# Altium schematic sheet protel_wireless_receiver.SchDoc
size A4
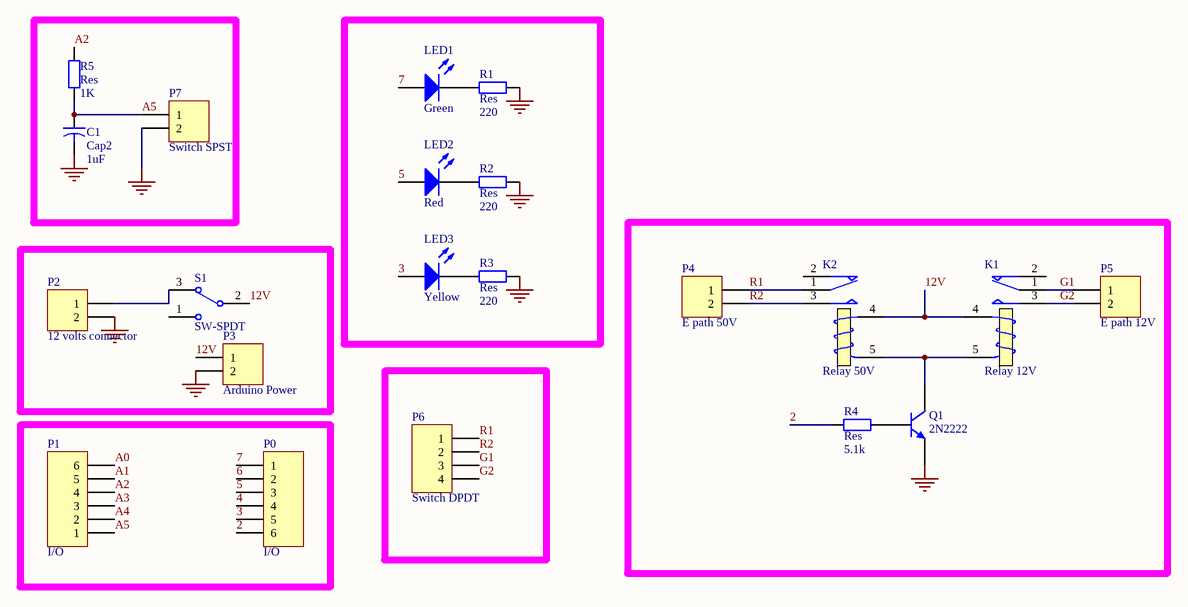
[diagram p0: protel_wireless_receiver.SchDoc]

## Parts
C1  Cap2  value 1uF  [CAPR5-4X5]
K1  Relay 12V  [relay 6pin]
K2  Relay 50V  [JS relay]
LED1  Green  [LED-1]
LED2  Red  [LED-1]
LED3  Yellow  [LED-1]
P0  I/O  [HDR1X6]
P1  I/O  [HDR1X6]
P2  12 volts connector  [HDR1X2]
P3  Arduino Power  [HDR1X2]
P4  E path 50V  [HDR1X2]
P5  E path 12V  [HDR1X2]
P6  Switch DPDT  [HDR1X4]
P7  Switch SPST  [HDR1X2]
Q1  2N2222  [CAN-3/D5.9]
R1  Res  value 220  [AXIAL-0.4]
R2  Res  value 220  [AXIAL-0.4]
R3  Res  value 220  [AXIAL-0.4]
R4  Res  value 5.1k  [AXIAL-0.4]
R5  Res  value 1K  [AXIAL-0.4]
S1  SW-SPDT  [SPDT]

## Nets
GND: C1.2 P2.2 P3.2 P7.2 Q1.1(E) R1.2 R2.2 R3.2
2: P0.6 R4.1
3: LED3.1(A) P0.5
4: P0.4
5: LED2.1(A) P0.3
6: P0.2
7: LED1.1(A) P0.1
12V: K1.4(T1) K2.4(T1) P3.1 S1.2
A0: P1.6
A1: P1.5
A2: P1.4 R5.2
A3: P1.3
A4: P1.2
A5: C1.1 P1.1 P7.1 R5.1
G1: K1.1(COM) P5.1 P6.3
G2: K1.3(NO) P5.2 P6.4
R1: K2.1(COM) P4.1 P6.1
R2: K2.3(NO) P4.2 P6.2
NetK1_5: K1.5(T2) K2.5(T2) Q1.3(C)
NetLED1_2: LED1.2(K) R1.1
NetLED2_2: LED2.2(K) R2.1
NetLED3_2: LED3.2(K) R3.1
NetP2_1: P2.1 S1.3
NetQ1_2: Q1.2(B) R4.2

Not connected (* = marked no-connect by the designer): K1 2(NC); K2 2(NC); S1 1

## Library data of the parts
C1 = Cap2: Capacitor; Published: 23-Sep-2002; Publisher: Altium Limited
K1 K2 = Relay: SPDT Relay; Published: 8-Jun-2000; LatestRevisionDate: 17-Jul-2002; LatestRevisionNote: Re-released for DXP Platform.; Publisher: Altium Limited
LED1-LED3 = LED1: Typical RED GaAs LED; Published: 8-Jun-2000; LatestRevisionDate: 17-Jul-2002; LatestRevisionNote: Re-released for DXP Platform.; Publisher: Altium Limited
P0 P1 = Header 6: Header, 6-Pin; LatestRevisionDate: 17-Jul-2002; LatestRevisionNote: Re-released for DXP Platform.; Publisher: Altium Limited
P2-P5 P7 = Header 2: Header, 2-Pin; LatestRevisionDate: 17-Jul-2002; LatestRevisionNote: Re-released for DXP Platform.; Publisher: Altium Limited
P6 = Header 4: Header, 4-Pin; LatestRevisionDate: 17-Jul-2002; LatestRevisionNote: Re-released for DXP Platform.; Publisher: Altium Limited
Q1 = 2N2222: General Purpose Transistor NPN Silicon; Published: 29-Sep-2000; LatestRevisionDate: 17-Jul-2002; LatestRevisionNote: Re-released for DXP Platform.; DatasheetVersion: 1991; PackageVersion: 1997; PackageReference: 22-03; Publisher: Altium Limited; PackageDescription: Can; 3 Leads; Pin Circle Dia. 2.54 mm; Lead Dia. 0.48 mm (max); ComponentLink1Description: Manufacturer Link; ComponentLink1URL: http://www.onsemi.com/site/products/landing?taxonomyID=194
R1-R5 = Res2: Resistor; Published: 8-Jun-2000; LatestRevisionDate: 17-Jul-2002; LatestRevisionNote: Re-released for DXP Platform.; Publisher: Altium Limited
S1 = SW-SPDT: SPDT Subminiature Toggle Switch, Right Angle Mounting, Vertical Actuation; Published: 24-Mar-1999; LatestRevisionDate: 17-Dec-2003; LatestRevisionNote: Schematic revised, PCB Footprint replaced.; DatasheetDocument: 05-Dec-2000; Publisher: Altium Limited